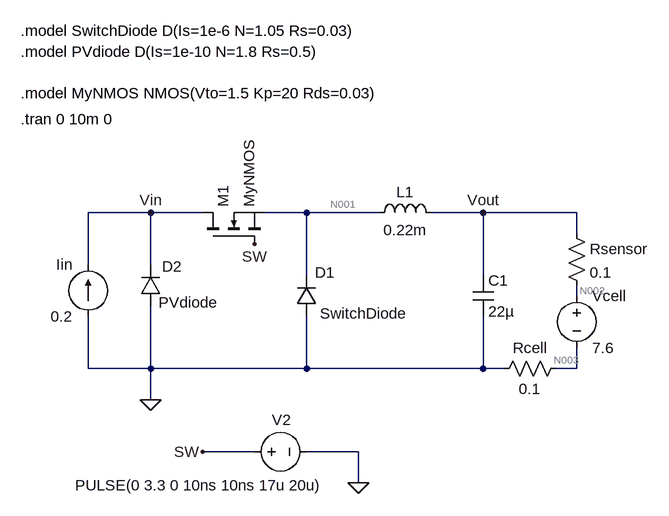
[diagram p0: schematic Buck Converter.asc]
Buck Converter.asc, the LTspice schematic file:
Version 4.1
SHEET 1 880 812
WIRE 0 16 -96 16
WIRE 80 16 0 16
WIRE 240 16 176 16
WIRE 352 16 240 16
WIRE 512 16 432 16
WIRE 656 16 512 16
WIRE 656 48 656 16
WIRE -96 96 -96 16
WIRE 0 96 0 16
WIRE 240 112 240 16
WIRE 512 112 512 16
WIRE 656 144 656 128
WIRE -96 256 -96 176
WIRE 0 256 0 160
WIRE 0 256 -96 256
WIRE 240 256 240 176
WIRE 240 256 0 256
WIRE 512 256 512 176
WIRE 512 256 240 256
WIRE 544 256 512 256
WIRE 656 256 656 224
WIRE 656 256 624 256
WIRE 0 304 0 256
WIRE 160 384 80 384
WIRE 320 384 240 384
WIRE 320 432 320 384
FLAG 0 304 0
FLAG 0 16 Vin
FLAG 512 16 Vout
FLAG 160 64 SW
FLAG 80 384 SW
FLAG 320 432 0
SYMBOL diode 256 176 R180
WINDOW 0 -28 68 Left 2
WINDOW 3 -138 5 Left 2
SYMATTR InstName D1
SYMATTR Value SwitchDiode
SYMBOL ind 336 32 R270
WINDOW 0 32 56 VTop 2
WINDOW 3 5 56 VBottom 2
SYMATTR InstName L1
SYMATTR Value 0.22m
SYMBOL nmos 80 64 R270
SYMATTR InstName M1
SYMATTR Value MyNMOS
SYMBOL voltage 144 384 R270
WINDOW 123 0 0 Left 0
WINDOW 39 0 0 Left 0
WINDOW 0 49 43 VRight 2
WINDOW 3 -52 -260 VRight 2
SYMATTR InstName V2
SYMATTR Value PULSE(0 3.3 0 10ns 10ns 17u 20u)
SYMBOL res 640 32 R0
SYMATTR InstName Rsensor
SYMATTR Value 0.1
SYMBOL voltage 656 128 R0
WINDOW 123 0 0 Left 0
WINDOW 39 0 0 Left 0
SYMATTR InstName Vcell
SYMATTR Value 7.6
SYMBOL res 640 240 R90
WINDOW 0 0 56 VBottom 2
WINDOW 3 32 56 VTop 2
SYMATTR InstName Rcell
SYMATTR Value 0.1
SYMBOL cap 496 112 R0
SYMATTR InstName C1
SYMATTR Value 22µ
SYMBOL current -96 176 R180
WINDOW 0 24 80 Left 2
WINDOW 3 24 0 Left 2
WINDOW 123 0 0 Left 0
WINDOW 39 0 0 Left 0
SYMATTR InstName Iin
SYMATTR Value 0.2
SYMBOL diode 16 160 R180
WINDOW 0 -32 61 Left 2
WINDOW 3 -87 6 Left 2
SYMATTR InstName D2
SYMATTR Value PVdiode
TEXT -200 -128 Left 2 !.tran 0 10m 0
TEXT -200 -168 Left 2 !.model MyNMOS NMOS(Vto=1.5 Kp=20 Rds=0.03)
TEXT -200 -232 Left 2 !.model PVdiode D(Is=1e-10 N=1.8 Rs=0.5)
TEXT -200 -264 Left 2 !.model SwitchDiode D(Is=1e-6 N=1.05 Rs=0.03)

The netlist it stands for:
* Buck Converter.asc
D1 0 N001 SwitchDiode
L1 N001 Vout 0.22m
M1 Vin SW N001 N001 MyNMOS
V2 SW 0 PULSE(0 3.3 0 10ns 10ns 17u 20u)
Rsensor Vout N002 0.1
Vcell N002 N003 7.6
Rcell N003 0 0.1
C1 Vout 0 22µ
Iin 0 Vin 0.2
D2 0 Vin PVdiode
.model D D
.lib standard.dio
.model NMOS NMOS
.model PMOS PMOS
.lib standard.mos
.tran 0 10m 0
.model MyNMOS NMOS(Vto=1.5 Kp=20 Rds=0.03)
.model PVdiode D(Is=1e-10 N=1.8 Rs=0.5)
.model SwitchDiode D(Is=1e-6 N=1.05 Rs=0.03)
.backanno
.end

* Results of the author's LTspice run, read from the files saved beside the schematic
* Operating Point, zero values left out:
*   V(vout) = 7.64 V
*   V(n002) = 7.62 V
*   V(n001) = 7.64 V
*   V(vin) = 7.646 V
*   V(n003) = 20 mV
*   Id(M1) = 200 mA
*   Is(M1) = -200 mA
*   I(Vcell) = 200 mA
*   I(D1) = -1 µA
*   I(Rsensor) = 200 mA
*   I(L1) = 200 mA
*   I(Rcell) = 200 mA
*   I(Iin) = 200 mA
*   I(D2) = -107.6 pA
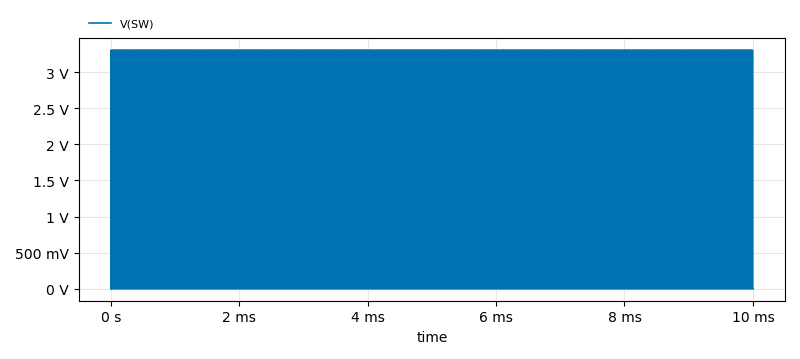
[diagram p1: Transient Analysis of Buck Converter.asc, plotted from the saved traces]
* Transient Analysis, 1 run:
*   V(SW): min 0 V, max 3.3 V, average 2.807 V, rms 3.043 V, last 0 V